# Altium schematic sheet main_top.SchDoc: SDL - Main
size Letter; Author: Ye-Sheng Kuo; Revision: 1; SheetNumber: 1; SheetTotal: 8
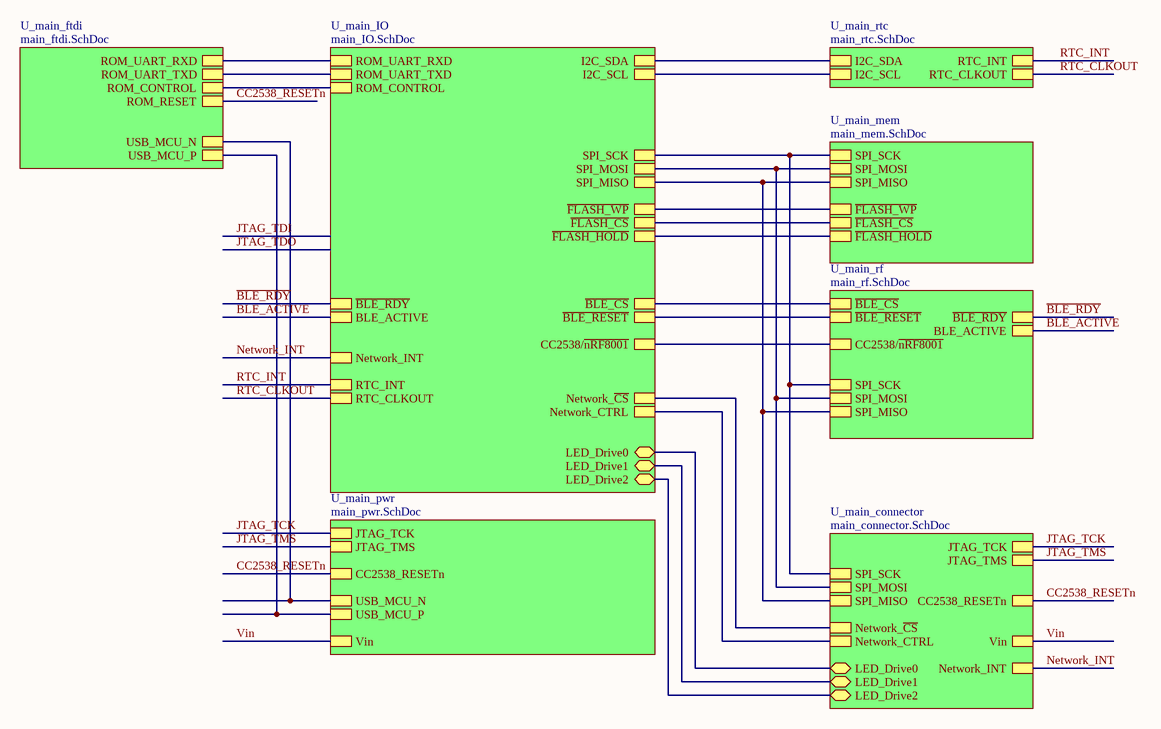
[diagram p0: main_top.SchDoc]

## Sub-sheets
U_main_connector = main_connector.SchDoc: Vin, JTAG_TCK, JTAG_TMS, CC2538_RESETn, SPI_SCK, SPI_MOSI, SPI_MISO, Network_~{CS}, Network_CTRL, Network_INT, LED_Drive0, LED_Drive1, LED_Drive2
U_main_ftdi = main_ftdi.SchDoc: ROM_UART_RXD, ROM_UART_TXD, ROM_CONTROL, ROM_RESET, USB_MCU_N, USB_MCU_P
U_main_IO = main_IO.SchDoc: ROM_UART_RXD, ROM_UART_TXD, ROM_CONTROL, I2C_SDA, I2C_SCL, SPI_SCK, SPI_MOSI, SPI_MISO, ~{FLASH_WP}, ~{FLASH_CS}, ~{FLASH_HOLD}, ~{BLE_RDY}, ~{BLE_CS}, BLE_ACTIVE, ~{BLE_RESET}, RTC_INT, RTC_CLKOUT, CC2538/~{nRF8001}, Network_~{CS}, Network_CTRL, Network_INT, LED_Drive0, LED_Drive1, LED_Drive2
U_main_mem = main_mem.SchDoc: ~{FLASH_WP}, ~{FLASH_CS}, ~{FLASH_HOLD}, SPI_SCK, SPI_MOSI, SPI_MISO
U_main_pwr = main_pwr.SchDoc: Vin, CC2538_RESETn, USB_MCU_N, USB_MCU_P, JTAG_TCK, JTAG_TMS
U_main_rf = main_rf.SchDoc: SPI_SCK, SPI_MOSI, SPI_MISO, ~{BLE_RDY}, ~{BLE_CS}, BLE_ACTIVE, ~{BLE_RESET}, CC2538/~{nRF8001}
U_main_rtc = main_rtc.SchDoc: RTC_CLKOUT, I2C_SDA, I2C_SCL, RTC_INT

## Nets
~{BLE_RDY}: sheet U_main_IO/~{BLE_RDY}, sheet U_main_rf/~{BLE_RDY}
BLE_ACTIVE: sheet U_main_IO/BLE_ACTIVE, sheet U_main_rf/BLE_ACTIVE
CC2538_RESETn: sheet U_main_connector/CC2538_RESETn, sheet U_main_ftdi/ROM_RESET, sheet U_main_pwr/CC2538_RESETn
JTAG_TCK: sheet U_main_connector/JTAG_TCK, sheet U_main_pwr/JTAG_TCK
JTAG_TMS: sheet U_main_connector/JTAG_TMS, sheet U_main_pwr/JTAG_TMS
Network_INT: sheet U_main_connector/Network_INT, sheet U_main_IO/Network_INT
RTC_CLKOUT: sheet U_main_IO/RTC_CLKOUT, sheet U_main_rtc/RTC_CLKOUT
RTC_INT: sheet U_main_IO/RTC_INT, sheet U_main_rtc/RTC_INT
Vin: sheet U_main_connector/Vin, sheet U_main_pwr/Vin
(unnamed): sheet U_main_connector/SPI_SCK, sheet U_main_IO/SPI_SCK, sheet U_main_mem/SPI_SCK, sheet U_main_rf/SPI_SCK
(unnamed): sheet U_main_connector/SPI_MOSI, sheet U_main_IO/SPI_MOSI, sheet U_main_mem/SPI_MOSI, sheet U_main_rf/SPI_MOSI
(unnamed): sheet U_main_connector/SPI_MISO, sheet U_main_IO/SPI_MISO, sheet U_main_mem/SPI_MISO, sheet U_main_rf/SPI_MISO
(unnamed): sheet U_main_connector/Network_~{CS}, sheet U_main_IO/Network_~{CS}
(unnamed): sheet U_main_connector/Network_CTRL, sheet U_main_IO/Network_CTRL
(unnamed): sheet U_main_connector/LED_Drive0, sheet U_main_IO/LED_Drive0
(unnamed): sheet U_main_connector/LED_Drive1, sheet U_main_IO/LED_Drive1
(unnamed): sheet U_main_connector/LED_Drive2, sheet U_main_IO/LED_Drive2
(unnamed): sheet U_main_ftdi/ROM_UART_RXD, sheet U_main_IO/ROM_UART_RXD
(unnamed): sheet U_main_ftdi/ROM_UART_TXD, sheet U_main_IO/ROM_UART_TXD
(unnamed): sheet U_main_ftdi/ROM_CONTROL, sheet U_main_IO/ROM_CONTROL
(unnamed): sheet U_main_ftdi/USB_MCU_N, sheet U_main_pwr/USB_MCU_N
(unnamed): sheet U_main_ftdi/USB_MCU_P, sheet U_main_pwr/USB_MCU_P
(unnamed): sheet U_main_IO/I2C_SDA, sheet U_main_rtc/I2C_SDA
(unnamed): sheet U_main_IO/I2C_SCL, sheet U_main_rtc/I2C_SCL
(unnamed): sheet U_main_IO/~{FLASH_WP}, sheet U_main_mem/~{FLASH_WP}
(unnamed): sheet U_main_IO/~{FLASH_CS}, sheet U_main_mem/~{FLASH_CS}
(unnamed): sheet U_main_IO/~{FLASH_HOLD}, sheet U_main_mem/~{FLASH_HOLD}
(unnamed): sheet U_main_IO/~{BLE_CS}, sheet U_main_rf/~{BLE_CS}
(unnamed): sheet U_main_IO/~{BLE_RESET}, sheet U_main_rf/~{BLE_RESET}
(unnamed): sheet U_main_IO/CC2538/~{nRF8001}, sheet U_main_rf/CC2538/~{nRF8001}

## Notes on the sheet
- Title
- Date:
- Author:
- Revision:
- Sheet
- of
- University of Michigan
- File: